# Altium project BLDC1.PrjPcb
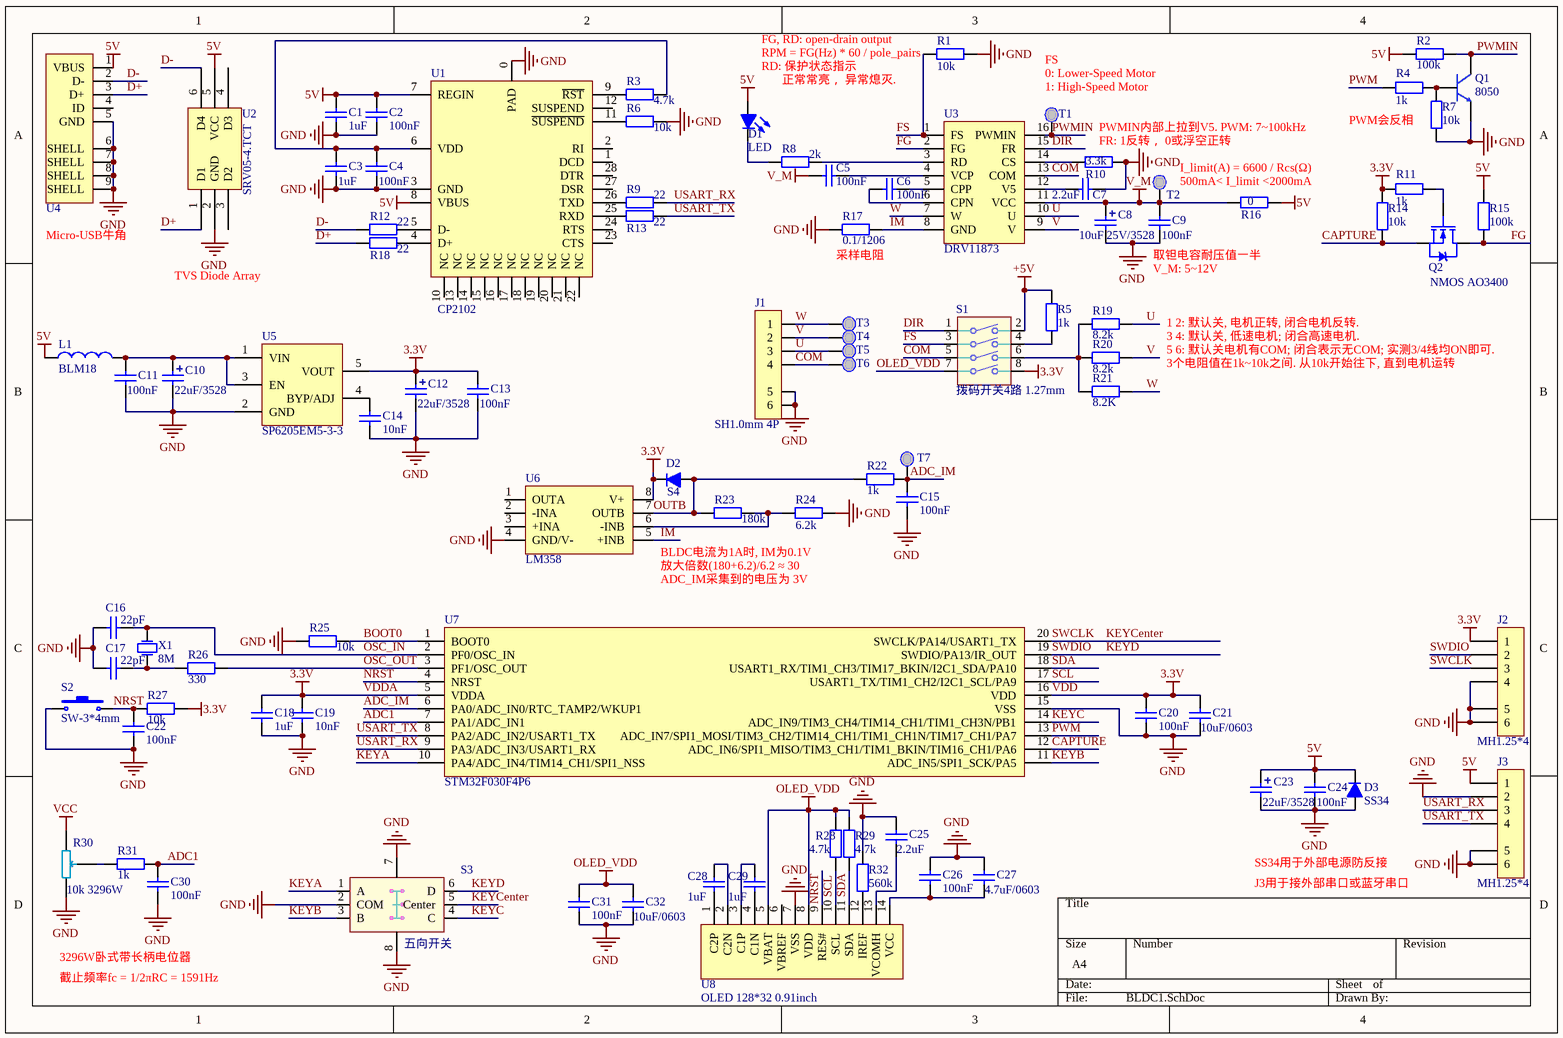
[diagram p0: BLDC1.SchDoc]
1 sheet, 92 parts. Net scope: global (net labels, ports and power ports of the same name join across sheets).
Board file: BLDC1.PcbDoc

## Sheet BLDC1.SchDoc
size A4

### Parts
C1  value 1uF  [C0402]  (hidden comment: Cap1)
C2  value 100nF  [C0402]  (hidden comment: Cap1)
C3  value 1uF  [C0402]  (hidden comment: Cap1)
C4  value 100nF  [C0402]  (hidden comment: Cap1)
C5  value 100nF  [C0402]  (hidden comment: Cap1)
C6  value 100nF  [C0402]  (hidden comment: Cap1)
C7  value 2.2uF  [0603]  (hidden comment: Cap1)
C8  value 10uF 25V/3528  [3528(22u16V钽电容)]  (hidden comment: Cap_Pol)
C9  value 100nF  [C0402]  (hidden comment: Cap1)
C10  value 22uF/3528  [3528(22u16V钽电容)]  (hidden comment: Cap_Pol)
C11  value 100nF  [C0402]  (hidden comment: Cap1)
C12  value 22uF/3528  [3528(22u16V钽电容)]  (hidden comment: Cap_Pol)
C13  value 100nF  [C0402]  (hidden comment: Cap1)
C14  value 10nF  [C0402]  (hidden comment: Cap1)
C15  value 100nF  [C0402]  (hidden comment: Cap1)
C16  value 22pF  [C0402]  (hidden comment: Cap1)
C17  value 22pF  [C0402]  (hidden comment: Cap1)
C18  value 1uF  [C0402]  (hidden comment: Cap1)
C19  value 10nF  [C0402]  (hidden comment: Cap1)
C20  value 100nF  [C0402]  (hidden comment: Cap1)
C21  value 10uF/0603  [0603]  (hidden comment: Cap1)
C22  value 100nF  [C0402]  (hidden comment: Cap1)
C23  value 22uF/3528  [3528(22u16V钽电容)]  (hidden comment: Cap_Pol)
C24  value 100nF  [C0402]  (hidden comment: Cap1)
C25  value 2.2uF  [0603]  (hidden comment: Cap1)
C26  value 100nF  [C0402]  (hidden comment: Cap1)
C27  value 4.7uF/0603  [0603]  (hidden comment: Cap1)
C28  value 1uF  [C0402]  (hidden comment: Cap1)
C29  value 1uF  [C0402]  (hidden comment: Cap1)
C30  value 100nF  [C0402]  (hidden comment: Cap1)
C31  value 100nF  [C0402]  (hidden comment: Cap1)
C32  value 10uF/0603  [0603]  (hidden comment: Cap1)
D1  LED  [DIODE-12]
D2  S4  [Diode-0805]
D3  SS34  [LC-SMA(DO-214AC)_S2]
J1  SH1.0mm 4P  [SH1.0 4P]
J2  MH1.25*4  [MH1.25*4立式表贴]
J3  MH1.25*4  [MH1.25*4立式表贴]
L1  BLM18  [CC0805]
Q1  8050  [SOT-23-3]
Q2  NMOS AO3400  [SOT-23-3 - AO3400]
R1  value 10k  [C0402]  (hidden comment: Res1)
R2  value 100k  [C0402]  (hidden comment: Res1)
R3  value 4.7k  [C0402]  (hidden comment: Res1)
R4  value 1k  [C0402]  (hidden comment: Res1)
R5  value 1k  [C0402]  (hidden comment: Res1)
R6  value 10k  [C0402]  (hidden comment: Res1)
R7  value 10k  [C0402]  (hidden comment: Res1)
R8  value 2k  [C0402]  (hidden comment: Res1)
R9  value 22  [C0402]  (hidden comment: Res1)
R10  value 3.3k  [C0402]  (hidden comment: Res1)
R11  value 1k  [C0402]  (hidden comment: Res1)
R12  value 22  [C0402]  (hidden comment: Res1)
R13  value 22  [C0402]  (hidden comment: Res1)
R14  value 10k  [C0402]  (hidden comment: Res1)
R15  value 100k  [C0402]  (hidden comment: Res1)
R16  value 0  [C0805]  (hidden comment: Res1)
R17  value 0.1/1206  [3216[1206]]  (hidden comment: Res1)
R18  value 22  [C0402]  (hidden comment: Res1)
R19  value 8.2k  [C0402]  (hidden comment: Res1)
R20  value 8.2k  [C0402]  (hidden comment: Res1)
R21  value 8.2K  [C0402]  (hidden comment: Res1)
R22  value 1k  [C0402]  (hidden comment: Res1)
R23  value 180k  [C0402]  (hidden comment: Res1)
R24  value 6.2k  [C0402]  (hidden comment: Res1)
R25  value 10k  [C0402]  (hidden comment: Res1)
R26  value 330  [C0402]  (hidden comment: Res1)
R27  value 10k  [C0402]  (hidden comment: Res1)
R28  value 4.7k  [C0402]  (hidden comment: Res1)
R29  value 4.7k  [C0402]  (hidden comment: Res1)
R30  10k 3296W  [3296W 卧式]
R31  value 1k  [C0402]  (hidden comment: Res1)
R32  value 560k  [C0402]  (hidden comment: Res1)
S1  拨码开关4路 1.27mm  [拨码开关4路]
S2  SW-3*4mm  [SW-3*4mm]
S3  五向开关  [五向开关]
T1  TEST  [TEST]  (value not drawn)
T2  TEST  [TEST]  (value not drawn)
T3  TEST  [TEST]  (value not drawn)
T4  TEST  [TEST]  (value not drawn)
T5  TEST  [TEST]  (value not drawn)
T6  TEST  [TEST]  (value not drawn)
T7  TEST  [TEST]  (value not drawn)
U1  CP2102  [LC-QFN-28_5x5x05P]
U2  SRV05-4.TCT  [LC-SOT-23-6]
U3  DRV11873  [HTSSOP16]
U4  Micro-USB-N  [Micro-USB-N]  (value not drawn)
U5  SP6205EM5-3-3  [LC-SOT-23-5]
U6  LM358  [LC-SOIC-8]
U7  STM32F030F4P6  [TSSOP20]
U8  OLED 128*32 0.91inch  [OLED 0.91 I2C]
X1  8M  [XTAL-3225]

### Nets
5V: C1.2 C2.2 C23.1 C24.2 D1.1(A) D3.2(K) J3.1 L1.1 R2.2 R15.2 R16.2 U1.7(REGIN) U1.8(VBUS) U2.5(VCC) U4.1(VBUS)
+5V: R5.1 S1.2
GND: C1.1 C2.1 C3.1 C4.1 C7.1 C8.2 C9.1 C10.2 C11.1 C12.2 C13.1 C14.1 C15.1 C16.1 C17.1 C18.1 C19.1 C20.1 C21.1 C22.1 C23.2 C24.1 C25.1 C26.2 C27.2 C30.1 C31.1 C32.1 D3.1(A) J1.5 J1.6 J2.4 J2.5 J2.6 J3.2 J3.5 J3.6 Q1.1(e) R1.1 R6.2 R7.1 R10.2 R17.2 R24.2 R25.2 R30.3 R32.2 S2.1 S3.2(COM) S3.7 S3.8 U1.0(PAD) U1.3(GND) U2.2(GND) U4.5(GND) U4.6(SHELL) U4.7(SHELL) U4.8(SHELL) U4.9(SHELL) U5.2(GND) U6.4(GND/V-) U7.15(VSS) U8.7(VSS)
OLED_VDD: C31.2 C32.2 R28.2 R29.2 S1.7 U8.5(VBAT) U8.8(VDD)
V_M: C5.2 C8.1 C9.2 R16.1 T2.1 U3.11(VCC)
VCC: R30.1
VDD: C12.1 C13.2 C18.2 C19.2 C20.2 C21.2 D2.2(K) J2.1 R11.1 R14.2 R27.1 S1.8 U5.5(VOUT) U6.8(V+) U7.5(VDDA) U7.16(VDD)  [also labelled 3.3V, VDDA]
ADC1: C30.2 R31.1 U7.7(PA1/ADC_IN1)
ADC_IM: C15.2 R22.1 T7.1 U7.6(PA0/ADC_IN0/RTC_TAMP2/WKUP1)
BOOT0: R25.1 U7.1(BOOT0)
CAPTURE: Q2.3(S) R14.1 U7.12(ADC_IN6/SPI1_MISO/TIM3_CH1/TIM1_BKIN/TIM16_CH1/PA6)
COM: J1.4 S1.5 T6.1 U3.13(COM)
D+: R18.1 U2.1(D1) U4.3(D+)
D-: R12.1 U2.6(D4) U4.2(D-)
DIR: S1.1 U3.15(FR)
FG: Q2.2(D) R15.1 U3.2(FG)
FS: R1.2 S1.3 U3.1(FS)
IM: R17.1 U3.8(GND) U6.5(+INB)
KEYA: S3.1(A) U7.10(PA4/ADC_IN4/TIM14_CH1/SPI1_NSS)
KEYB: S3.3(B) U7.11(ADC_IN5/SPI1_SCK/PA5)
KEYC: S3.4(C) U7.14(ADC_IN9/TIM3_CH4/TIM14_CH1/TIM1_CH3N/PB1)
KEYCenter: J2.3 S3.5(Center) U7.20(SWCLK/PA14/USART1_TX)  [also labelled SWCLK]
KEYD: J2.2 S3.6(D) U7.19(SWDIO/PA13/IR_OUT)  [also labelled SWDIO]
NRST: C22.2 R27.2 S2.2 U7.4(NRST) U8.9(RES#)
OSC_IN: C16.2 U7.2(PF0/OSC_IN) X1.2(OSC2)
OSC_OUT: R26.1 U7.3(PF1/OSC_OUT)
OUTB: D2.1(A) R22.2 R23.1 U6.7(OUTB)
PWM: R4.1 U7.13(ADC_IN7/SPI1_MOSI/TIM3_CH2/TIM14_CH1/TIM1_CH1N/TIM17_CH1/PA7)
PWMIN: Q1.3(c) R2.1 T1.1 U3.16(PWMIN)
SCL: R28.1 U7.17(USART1_TX/TIM1_CH2/I2C1_SCL/PA9) U8.10(SCL)
SDA: R29.1 U7.18(USART1_RX/TIM1_CH3/TIM17_BKIN/I2C1_SDA/PA10) U8.11(SDA)
U: J1.3 R19.1 T5.1 U3.10(U)
USART_RX: J3.3 R9.2 U7.9(PA3/ADC_IN3/USART1_RX)
USART_TX: J3.4 R13.2 U7.8(PA2/ADC_IN2/USART1_TX)
V: J1.2 R20.1 T4.1 U3.9(V)
W: J1.1 R21.1 T3.1 U3.7(W)
NetC3_2: C3.2 C4.2 R3.2 U1.6(VDD)
NetC5_1: C5.1 U3.4(VCP)
NetC6_1: C6.1 U3.5(CPP)
NetC6_2: C6.2 U3.6(CPN)
NetC7_2: C7.2 U3.12(V5)
NetC10_1: C10.1 C11.2 L1.2 U5.1(VIN) U5.3(EN)
NetC14_2: C14.2 U5.4(BYP/ADJ)
NetC17_2: C17.2 R26.2 X1.1(OSC1)
NetC25_2: C25.2 U8.13(VCOMH)
NetC26_1: C26.1 C27.1 U8.14(VCC)
NetC28_1: C28.1 U8.1(C2P)
NetC28_2: C28.2 U8.2(C2N)
NetC29_1: C29.1 U8.4(C1N)
NetC29_2: C29.2 U8.3(C1P)
NetD1_2: D1.2(K) R8.2
NetQ1_2: Q1.2(b) R4.2 R7.2
NetQ2_1: Q2.1(G) R11.2
NetR3_1: R3.1 U1.9(~{RST})
NetR5_2: R5.2 S1.4
NetR6_1: R6.1 U1.11(~{SUSPEND})
NetR8_1: R8.1 U3.3(RD)
NetR9_1: R9.1 U1.26(TXD)
NetR10_1: R10.1 U3.14(CS)
NetR12_2: R12.2 U1.5(D-)
NetR13_1: R13.1 U1.25(RXD)
NetR18_2: R18.2 U1.4(D+)
NetR19_2: R19.2 R20.2 R21.2 S1.6
NetR23_2: R23.2 R24.1 U6.6(-INB)
NetR30_2: R30.2 R31.2
NetR32_1: R32.1 U8.12(IREF)

Not connected (* = marked no-connect by the designer): U1 1(DCD) 2(RI) 10(NC) 12(SUSPEND) 13(NC) 14(NC) 15(NC) 16(NC) 17(NC) 18(NC) 19(NC) 20(NC) 21(NC) 22(NC) 23(CTS) 24(RTS) 27(DSR) 28(DTR); U2 3(D2) 4(D3); U4 4(ID); U6 1(OUTA) 2(-INA) 3(+INA); U8 6(VBREF)

### Notes on the sheet
- (near R1) FG, RD: open-drain output
- (near D1) RD: 保护状态指示
- (near R1) RPM = FG(Hz) * 60 / pole_pairs
- (near D1) 正常常亮， 异常熄灭.
- 0: Lower-Speed Motor
- (near T1) 1: High-Speed Motor
- FS
- (near R10) FR: 1反转， 0或浮空正转
- (near R10) PWMIN内部上拉到V5.
- I_limit(A) = 6600 / Rcs(Ω)
- PWM: 7~100kHz
- (near R4) PWM会反相
- (near U4) Micro-USB牛角
- 500mA< I_limit <2000mA
- TVS Diode Array
- (near R17) 采样电阻
- (near C9) 取钽电容耐压值一半
- (near C9) V_M: 5~12V
- 5 6: 默认关电机有COM; 闭合表示无COM; 实测3/4线均ON即可.
- 1 2: 默认关, 电机正转, 闭合电机反转.
- 3 4: 默认关, 低速电机; 闭合高速电机.
- 3个电阻值在1k~10k之间. 从10k开始往下, 直到电机运转
- BLDC电流为1A时, IM为0.1V
- 放大倍数(180+6.2)/6.2 ≈ 30
- ADC_IM采集到的电压为 3V
- SS34用于外部电源防反接
- J3用于接外部串口或蓝牙串口
- 截止频率fc = 1/2πRC = 1591Hz
- 3296W卧式带长柄电位器

### Library data of the parts
C1-C7 C9 C11 C13-C22 C24-C32 = Cap1: Capacitor; Published: 8-Jun-2000; LatestRevisionDate: 17-Jul-2002; LatestRevisionNote: Re-released for DXP Platform.; PackageReference: RAD-0.3; Publisher: Altium Limited
C8 C10 C12 C23 = Cap_Pol: Capacitor; Published: 8-Jun-2000; LatestRevisionDate: 17-Jul-2002; LatestRevisionNote: Re-released for DXP Platform.; PackageReference: RAD-0.3; Publisher: Altium Limited
D1 = LED1: Typical INFRARED GaAs LED; Published: 8-Jun-2000; LatestRevisionDate: 08-Jul-2005; LatestRevisionNote: Mech Layer 1 removed.; PackageReference: LED-0; Publisher: Altium Limited
D2 D3 = Diode1
J2 J3 = MH1.25*4卧式贴片
Q1 = NPN
Q2 = NMOS: N-Channel Power MOSFET; Note: Pin 2 is electrically connected to pin 4.; Published: 8-Jun-2000; LatestRevisionDate: 17-Jul-2002; LatestRevisionNote: Re-released for DXP Platform.; DatasheetDocument: PD-9.814; PackageReference: TO-220AB; Publisher: Altium Limited; Code_JEDEC: TO-220-AB; ComponentLink1Description: Manufacturer Link; ComponentLink1URL: http://www.irf.com/
R1-R29 R31 R32 = Res1: Resistor; Published: 8-Jun-2000; LatestRevisionDate: 17-Jul-2002; LatestRevisionNote: Re-released for DXP Platform.; PackageReference: AXIAL-0.4; Publisher: Altium Limited
R30 = Res_3296
S2 = SW-3*4mm: Switch; Published: 24-Mar-1999; LatestRevisionDate: 17-Jul-2002; LatestRevisionNote: Re-released for DXP Platform.; PackageReference: SPST-2; Publisher: Altium Limited
S3 = 五向开关: Switch; Published: 24-Mar-1999; LatestRevisionDate: 17-Jul-2002; LatestRevisionNote: Re-released for DXP Platform.; PackageReference: SOT23-6; Publisher: Altium Limited
U5 = SP6205EM5-L-3-3
U8 = OLED 12832 I2C
X1 = XTAL_1: Crystal Oscillator; Published: 8-Jun-2000; LatestRevisionDate: 17-Jul-2002; LatestRevisionNote: Re-released for DXP Platform.; PackageReference: R38; Publisher: Altium Limited